# Altium schematic sheet MotionClockSchematic.SchDoc
size A4; SheetNumber: 1; SheetTotal: 1
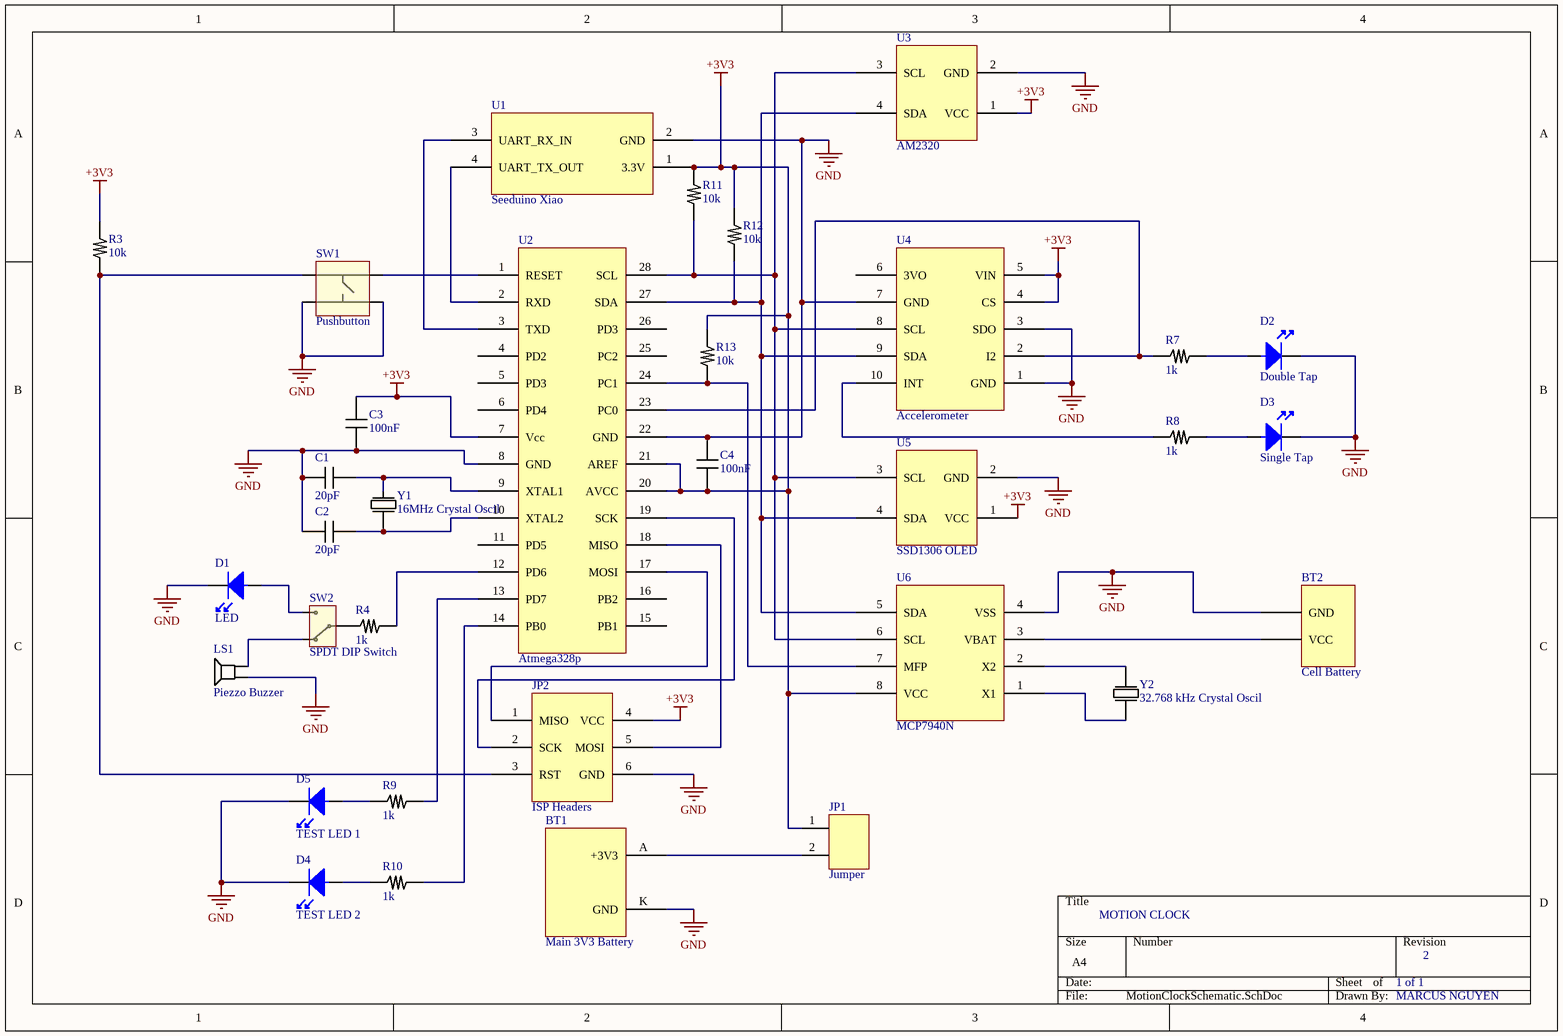
[diagram p0: MotionClockSchematic.SchDoc]

## Parts
BT1  Main 3V3 Battery  [Main Battery Pins]
BT2  Cell Battery  [Cell Holder]
C1  20pF  [Capacitor]
C2  20pF  [Capacitor]
C3  100nF  [Capacitor]
C4  100nF  [Capacitor]
D1  LED  [LED]
D2  Double Tap  [LED]
D3  Single Tap  [LED]
D4  TEST LED 2  [LED]
D5  TEST LED 1  [LED]
JP1  Jumper  [Jumper]
JP2  ISP Headers  [ISP Header]
LS1  Piezzo Buzzer  [Piezzo Buzzer v2]
R3  10k  [Resistor]
R4  1k  [Resistor]
R7  1k  [Resistor]
R8  1k  [Resistor]
R9  1k  [Resistor]
R10  1k  [Resistor]
R11  10k  [Resistor]
R12  10k  [Resistor]
R13  10k  [Resistor]
SW1  Pushbutton
SW2  SPDT DIP Switch  [SPDT]
U1  Seeduino Xiao  [Seeduino Xiao]
U2  Atmega328p  [Atmega328p]
U3  AM2320  [AM2320]
U4  Accelerometer  [Accel]
U5  SSD1306 OLED  [SSD1306]
U6  MCP7940N  [MCP7940N]
Y1  16MHz Crystal Oscil  [16MHz Crystal]
Y2  32.768 kHz Crystal Oscil  [32.768kHz]

## Nets
+3V3: C3.2 C4.1 JP1.1(VCC) JP2.4(VCC) R3.1 R11.2 R12.2 R13.1 U1.1(3.3V) U2.7(Vcc) U2.20(AVCC) U2.21(AREF) U3.1(VCC) U4.4(CS) U4.5(VIN) U5.1(VCC) U6.8(VCC)
GND: BT1.K(GND) BT2.K(GND) C1.1 C2.2 C3.1 C4.2 D1.K D2.K D3.K D4.K D5.K JP2.6(GND) LS1.K SW1.2 SW1.4 U1.2(GND) U2.8(GND) U2.22(GND) U3.2(GND) U4.1(GND) U4.3(SDO) U4.7(GND) U5.2(GND) U6.4(VSS)
NetBT1_A: BT1.A(+3V3) JP1.2(GND)
NetBT2_A: BT2.A(VCC) U6.3(VBAT)
NetC1_2: C1.2 U2.9(XTAL1) Y1.2
NetC2_1: C2.1 U2.10(XTAL2) Y1.1
NetD1_A: D1.A SW2.3
NetD2_A: D2.A R7.2
NetD3_A: D3.A R8.2
NetD4_A: D4.A R10.1
NetD5_A: D5.A R9.1
NetJP2_1: JP2.1(MISO) U2.17(MOSI)
NetJP2_2: JP2.2(SCK) U2.19(SCK)
NetJP2_3: JP2.3(RST) R3.2 SW1.1
NetJP2_5: JP2.5(MOSI) U2.18(MISO)
NetLS1_A: LS1.A SW2.2
NetR4_1: R4.1 SW2.1
NetR4_2: R4.2 U2.12(PD6)
NetR7_1: R7.1 U2.23(PC0) U4.2(I2)
NetR8_1: R8.1 U4.10(INT)
NetR9_2: R9.2 U2.13(PD7)
NetR10_2: R10.2 U2.14(PB0)
NetR11_1: R11.1 U2.28(SCL) U3.3(SCL) U4.8(SCL) U5.3(SCL) U6.6(SCL)
NetR12_1: R12.1 U2.27(SDA) U3.4(SDA) U4.9(SDA) U5.4(SDA) U6.5(SDA)
NetR13_2: R13.2 U2.24(PC1) U6.7(MFP)
NetSW1_3: SW1.3 U2.1(RESET)
NetU1_3: U1.3(UART_RX_IN) U2.3(TXD)
NetU1_4: U1.4(UART_TX_OUT) U2.2(RXD)
NetU6_1: U6.1(X1) Y2.1
NetU6_2: U6.2(X2) Y2.2

Not connected (* = marked no-connect by the designer): U2 4(PD2) 5(PD3) 6(PD4) 11(PD5) 15(PB1) 16(PB2) 25(PC2) 26(PD3); U4 6(3VO)

## Notes on the sheet
- MOTION CLOCK
- 1 of 1
- 2
- MARCUS NGUYEN

## Library data of the parts
C1-C4 = Capacitor
D2-D5 = LED
R3 R11-R13 = 10k Resistor
R4 R7-R10 = 1k Resistor